# Altium schematic sheet Power_Converter.SchDoc
size A
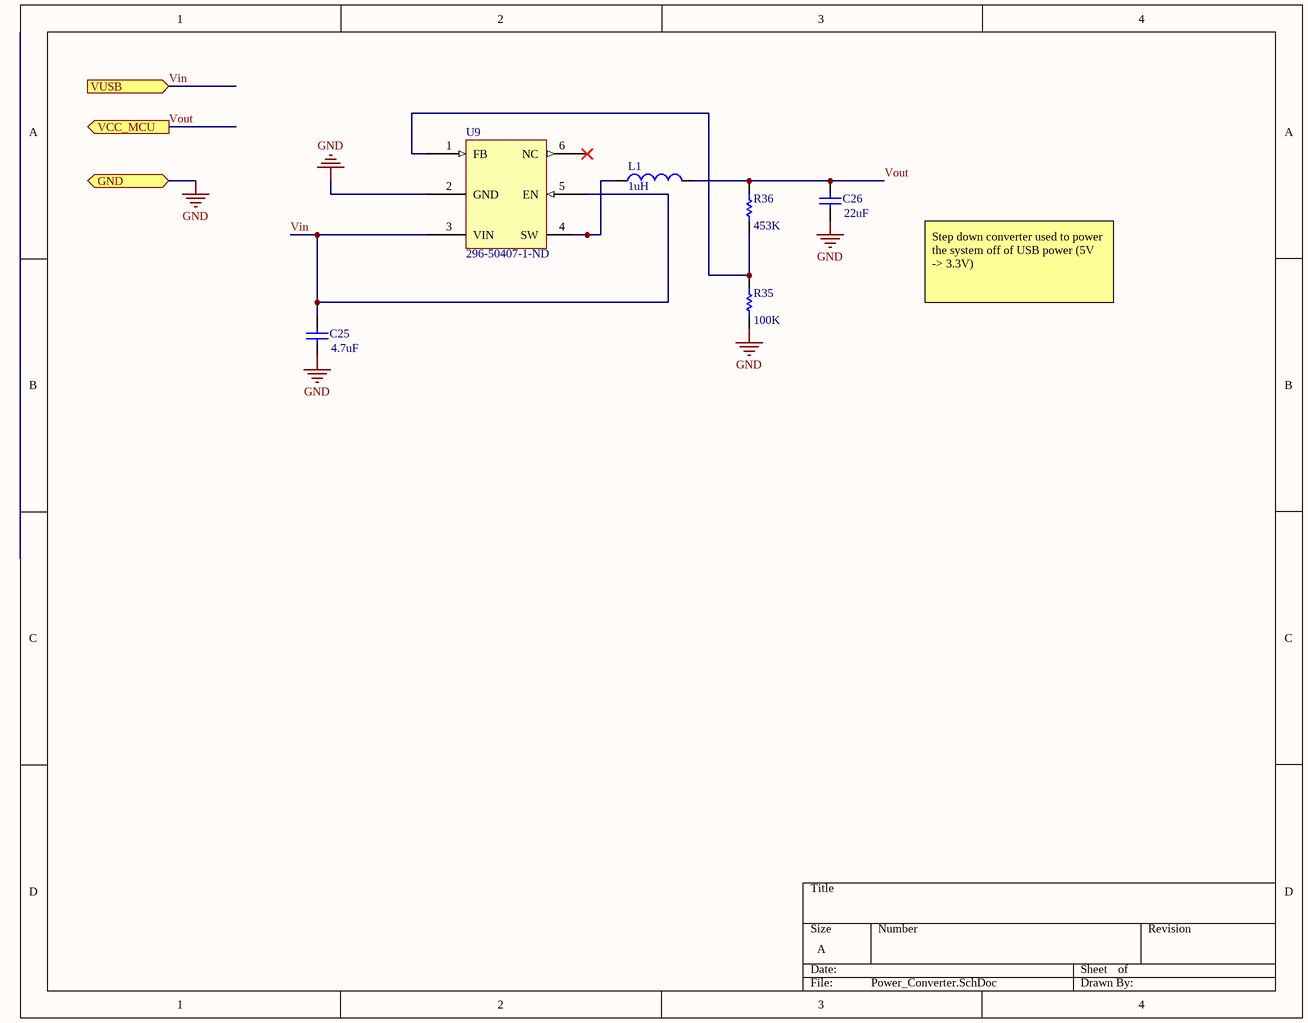
[diagram p0: Power_Converter.SchDoc]

## Parts
C25  value 4.7uF  [1608[0603]]  (hidden comment: Cap)
C26  value 22uF  [1608[0603]]  (hidden comment: Cap)
L1  value 1uH  [DFE252012F]  (hidden comment: Inductor)
R35  value 100K  [0402]  (hidden comment: Res1)
R36  value 453K  [6-0805_L]  (hidden comment: Res1)
U9  Supplier Part Number 1: 296-50407-1-ND  [TLV62568-SOT563]  (hidden comment: TLV62568DRL)

## Ports
GND (bidir), VCC_MCU (out), VUSB (in)

## Nets
GND: C25.1 C26.1 R35.1 U9.2(GND) ; port GND
Vin: C25.2 U9.3(VIN) U9.5(EN) ; port VUSB
Vout: C26.2 L1.2 R36.2 ; port VCC_MCU
NetL1_1: L1.1 U9.4(SW)
NetR35_2: R35.2 R36.1 U9.1(FB)

Not connected (* = marked no-connect by the designer): U9 6(NC)*

## Notes on the sheet
- Step down converter used to power the system off of USB power (5V -> 3.3V)

## Library data of the parts
C25 = Cap: 4.7 uF 10V 0603; Published: 8-Jun-2000; LatestRevisionDate: 17-Jul-2002; LatestRevisionNote: Re-released for DXP Platform.; PackageReference: RAD-0.3; Publisher: Altium Limited; PackageDescription: Radial Cap, Thru-Hole; 2 Leads; 0.3 in Pin Spacing
C26 = Cap: Capacitor; Published: 8-Jun-2000; LatestRevisionDate: 17-Jul-2002; LatestRevisionNote: Re-released for DXP Platform.; PackageReference: RAD-0.3; Publisher: Altium Limited; PackageDescription: Radial Cap, Thru-Hole; 2 Leads; 0.3 in Pin Spacing
L1 = Inductor: Code_IEC: 1005; Published: 8-Jun-2000; LatestRevisionDate: 29-May-2009; LatestRevisionNote: IPC-7351 Footprint Added.; PackageReference: 0402-A; Publisher: Altium Limited; PackageDescription: Chip Inductor; Code_JEITA: 0402
R35 R36 = Res1: Resistor; Published: 8-Jun-2000; LatestRevisionDate: 17-Jul-2002; LatestRevisionNote: Re-released for DXP Platform.; PackageReference: AXIAL-0.3; Publisher: Altium Limited; PackageDescription: Axial Device, Thru-Hole; 2 Leads; 0.3 in Pin Spacing
U9 = TLV62568ADRL: This is a buck/boost converter designed by Texas Instruments; Manufacturer Part Number: TLV62568ADRLR; Supplier 1: Digi-Key; Manufacturer: Texas Instruments; Stock 1: 2339; Pricing 1: 1 = 1.14000, 10 = 1.01500, 100 = 0.79120, 500 = 0.65364, 1000 = 0.51603 (USD)